# EAGLE design linefollower (EAGLE 9.4.2)
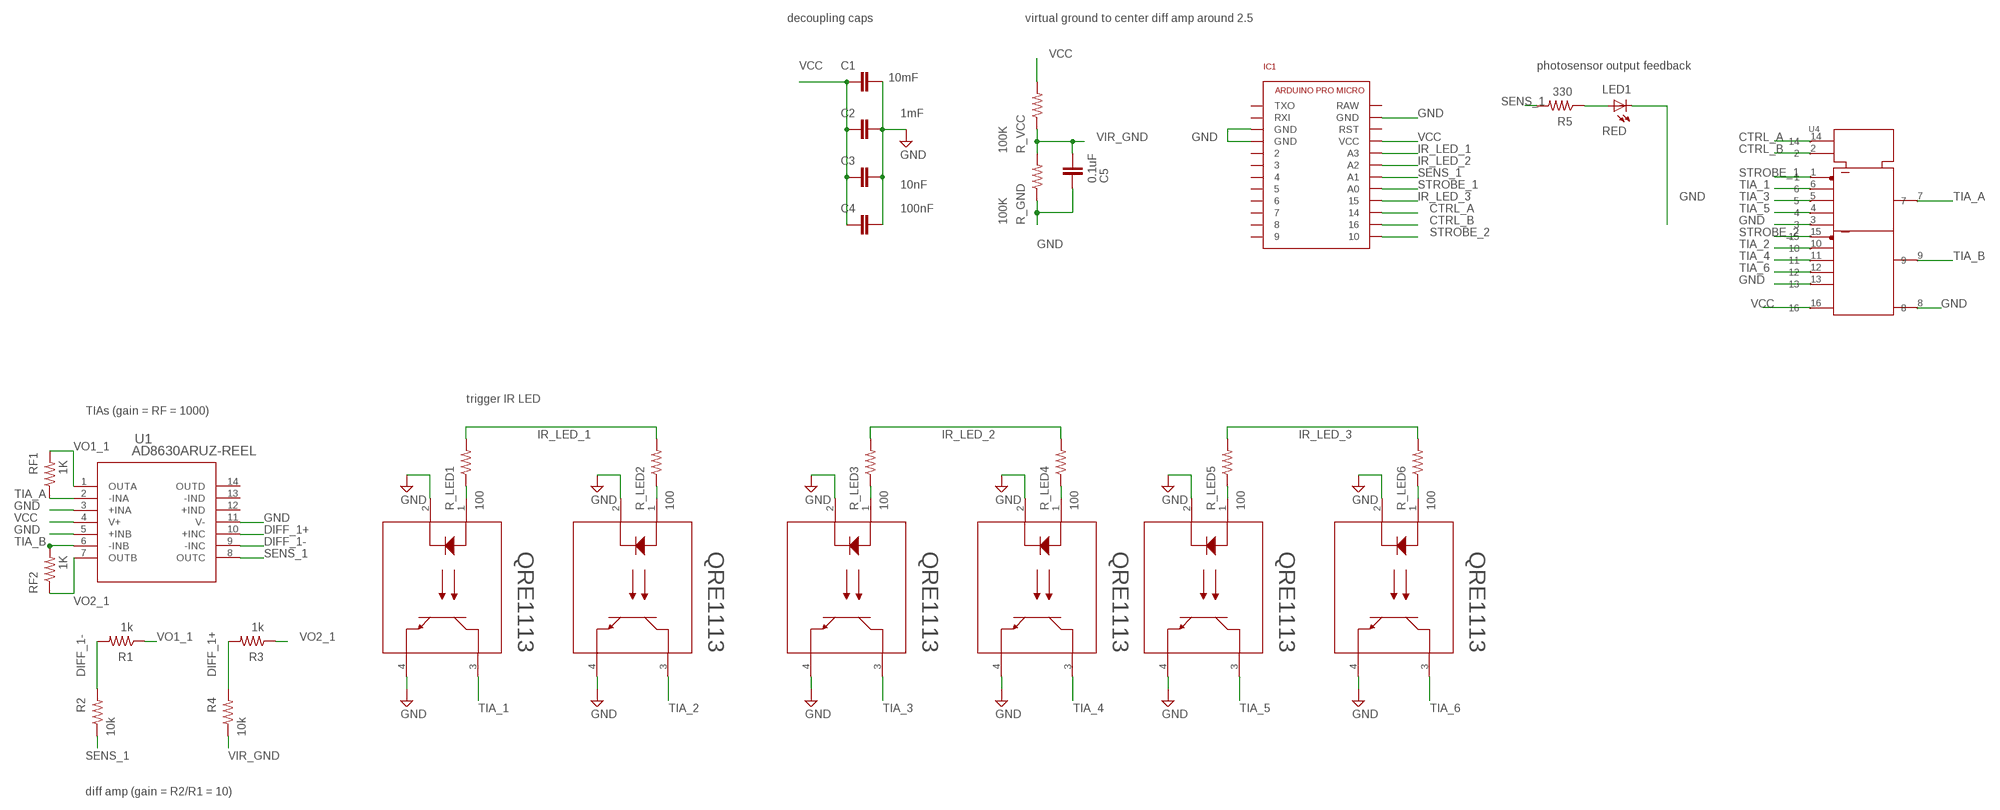
[diagram p0: schematic, sheet 1]

## Parts
C1  10mF  CAP0402-CAP  [0402-CAP]
C2  1mF  CAP0402-CAP  [0402-CAP]
C3  10nF  CAP0402-CAP  [0402-CAP]
C4  100nF  CAP0402-CAP  [0402-CAP]
C5  0.1uF  CAP0402-CAP  [0402-CAP]
IC1  ARDUINO_PRO_MICRO  [ARDUINO_PRO_MICRO]
LED1  RED  LED0603  [LED-0603]
Q1  QRE1113  [DIP4_100AQ_ONS]
Q2  QRE1113  [DIP4_100AQ_ONS]
Q3  QRE1113  [DIP4_100AQ_ONS]
Q4  QRE1113  [DIP4_100AQ_ONS]
Q5  QRE1113  [DIP4_100AQ_ONS]
Q6  QRE1113  [DIP4_100AQ_ONS]
R1  1k  R-US_R0603  [R0603]
R2  10k  R-US_R0603  [R0603]
R3  1k  R-US_R0603  [R0603]
R4  10k  R-US_R0603  [R0603]
R5  330  R-US_R0603  [R0603]
R_GND  100K  R-US_R0603  [R0603]
R_LED1  100  R-US_R0603  [R0603]
R_LED2  100  R-US_R0603  [R0603]
R_LED3  100  R-US_R0603  [R0603]
R_LED4  100  R-US_R0603  [R0603]
R_LED5  100  R-US_R0603  [R0603]
R_LED6  100  R-US_R0603  [R0603]
R_VCC  100K  R-US_R0603  [R0603]
RF1  1K  R-US_R0603  [R0603]
RF2  1K  R-US_R0603  [R0603]
U1  AD8630ARUZ-REEL  [RU_14_ADI]
U4  74VHC153FT(BJ)  [TSSOP16B_TOS]

## Nets
CTRL_A: IC1.14 U4.14
CTRL_B: IC1.16 U4.2
DIFF_1+: R3.2 R4.2 U1.10(+INC)
DIFF_1-: R1.2 R2.2 U1.9(-INC)
GND: C1.2 C2.2 C3.2 C4.2 C5.1 IC1.GND@0(GND) IC1.GND@1(GND) IC1.GND@2(GND) LED1.C Q1.2 Q1.4 Q2.2 Q2.4 Q3.2 Q3.4 Q4.2 Q4.4 Q5.2 Q5.4 Q6.2 Q6.4 R_GND.1 U1.3(+INA) U1.5(+INB) U1.11(V-) U4.3 U4.8 U4.13
IR_LED_1: IC1.A3 R_LED1.2 R_LED2.2
IR_LED_2: IC1.A2 R_LED3.2 R_LED4.2
IR_LED_3: IC1.15 R_LED5.2 R_LED6.2
N$1: Q2.1 R_LED2.1
N$2: LED1.A R5.1
N$3: Q1.1 R_LED1.1
N$6: Q3.1 R_LED3.1
N$7: Q4.1 R_LED4.1
N$8: Q5.1 R_LED5.1
N$9: Q6.1 R_LED6.1
SENS_1: IC1.A1 R2.1 R5.2 U1.8(OUTC)
STROBE_1: IC1.A0 U4.1
STROBE_2: IC1.10 U4.15
TIA_1: Q1.3 U4.6
TIA_2: Q2.3 U4.10
TIA_3: Q3.3 U4.5
TIA_4: Q4.3 U4.11
TIA_5: Q5.3 U4.4
TIA_6: Q6.3 U4.12
TIA_A: RF1.1 U1.2(-INA) U4.7
TIA_B: RF2.2 U1.6(-INB) U4.9
VCC: C1.1 C2.1 C3.1 C4.1 IC1.VCC R_VCC.2 U1.4(V+) U4.16
VIR_GND: C5.2 R4.1 R_GND.2 R_VCC.1
VO1_1: R1.1 RF1.2 U1.1(OUTA)
VO2_1: R3.1 RF2.1 U1.7(OUTB)
Unconnected: IC1.2 IC1.3 IC1.4 IC1.5 IC1.6 IC1.7 IC1.8 IC1.9 IC1.RAW IC1.RST IC1.RXI IC1.TXO U1.12(+IND) U1.13(-IND) U1.14(OUTD)

## Notes on the sheet
- decoupling caps | virtual ground to center diff amp around 2.5
- photosensor output feedback
- trigger IR LED
- TIAs (gain = RF = 1000)
- diff amp (gain = R2/R1 = 10)

## Library data of the parts
C1-C5 = pie:CAP: Capacitor Standard 0603 ceramic capacitor, and 0.1" leaded capacitor.; PIE-INT-REF-NUM: CAPACITOR-GENERIC
IC1 = pie:ARDUINO_PRO_MICRO: Arduino Pro Micro Electrical System Year 9's Smart Sensor Core Pin Outs <https://cdn.sparkfun.com/assets/9/c/3/c/4/523a1765757b7f5c6e8b4567.png> Buy Here <http://www.aliexpress.com/item/Mini-Leonardo-Pro-Micro-ATmega32U4-5V-16MHz-Module-For-Arduino-Best-Quality/32284746884.html?ws_ab_test=searchweb201556_8,searchweb201602_2_10057_10056_10065_10055_10054_10067_10069_10059_10058_10017_10070_10060_10061_10052_10062_10053_10050_10051,searchweb201603_1&btsid=45993952-29ca-4de4-a0fb-c7fb72b8e1a5> Thru Hole Female Pins <http://www.digikey.com/product-search/en?keywords=929974E-01-12-ND> Surface Mount Female Pins <http://www.digikey.com/product-detail/en/sullins-connector-solutions/NPTC121KFXC-RC/S5604-ND/776062>; DESCRIPTION: Arduino Pro Micro; DISTRIBUTOR: AliExpress; DISTRIBUTOR_PART_NUMBER: 32284746884; MANUFACTURER: Feiyang electronics; NOTES: https://www.aliexpress.com/item/Mini-Leonardo-Pro-Micro-ATmega32U4-5V-16MHz-Module-For-Arduino-Best-Quality/32284746884.html?ws_ab_test=searchweb201556_8,searchweb201602_2_10057_10056_10065_10055_10054_10067_10069_10059_10058_10017_10070_10060_10061_10052_10062_10053_10050_10051,searchweb201603_1&btsid=45993952-29ca-4de4-a0fb-c7fb72b8e1a5; PACKAGE: ARDUINO_PRO_MICRO; REFERENCE_DEST: ARDUINO_PRO_MICRO
LED1 = pie:LED: LEDs Standard schematic elements and footprints for 5mm, 3mm, 1206, and 0603 sized LEDs. 5mm - Spark Fun Electronics SKU : COM-00529 (and others); DESCRIPTION: LEDs; DISTRIBUTOR: DigiKey; DISTRIBUTOR_PART_NUMBER: 160-1415-1-ND; MANUFACTURER: Lite-On Inc; MANUFACTURER_PART_NUMBER: LTST-C170KRKT; PACKAGE: LED0603; VALUE: COLOR
Q1-Q6 = pie:QRE1113; BUILT_BY: EMA_Cory; COPYRIGHT: Copyright (C) 2018 Accelerated Designs. All rights reserved; DATASHEET: https://www.onsemi.com/pub/Collateral/QRE1113-D.PDF; MANUFACTURER_PART_NUMBER: QRE1113; SOURCELIBRARY: ON_Semiconudctor_2020-04-15; VENDOR: ON Semiconductor
R1-R5 R_GND R_LED1-R_LED6 R_VCC RF1 RF2 = pie:R-US_: RESISTOR, American symbol; DESCRIPTION: RESISTOR, American symbol; DISTRIBUTOR: DigiKey; MANUFACTURER: Rohm Semiconductor; NOTES: Cut Tape; PACKAGE: R0603; VALUE: >VALUE
U1 = pie:AD8630ARUZ-REEL; BUILT_BY: EMA_Christopher; COPYRIGHT: Copyright (C) 2016 Accelerated Designs. All rights reserved; MANUFACTURER_PART_NUMBER: AD8630ARUZ-REEL; SOURCELIBRARY: Analog_Devices_2018-07-13; VENDOR: Analog Devices Inc
U4 = pie:74VHC153FT(BJ); BUILT_BY: EMA_UL_Team; COPYRIGHT: Copyright (C) 2018 Accelerated Designs. All rights reserved; MANUFACTURER_PART_NUMBER: 74VHC153FT(BJ); SOURCELIBRARY: Toshiba_2019-12-10; VENDOR: Toshiba

## Board
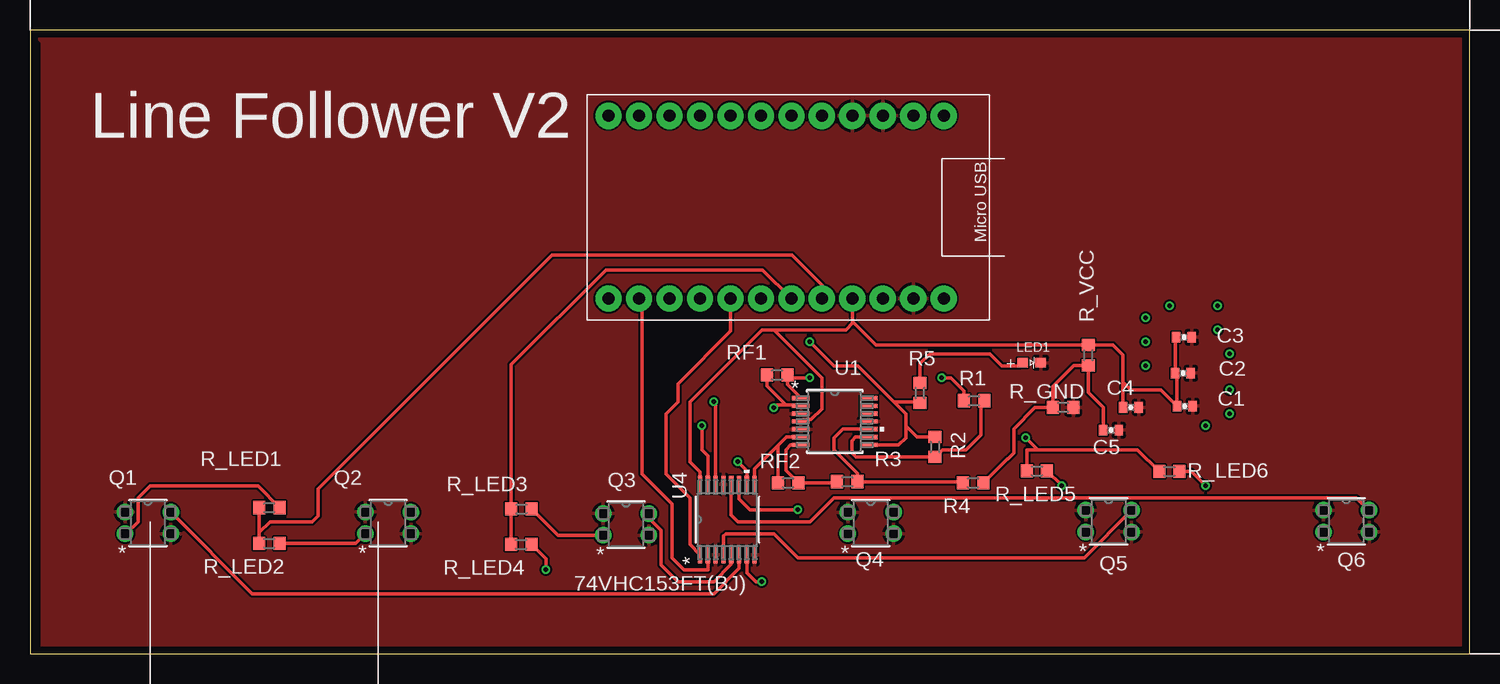
[diagram p1: board, top side]
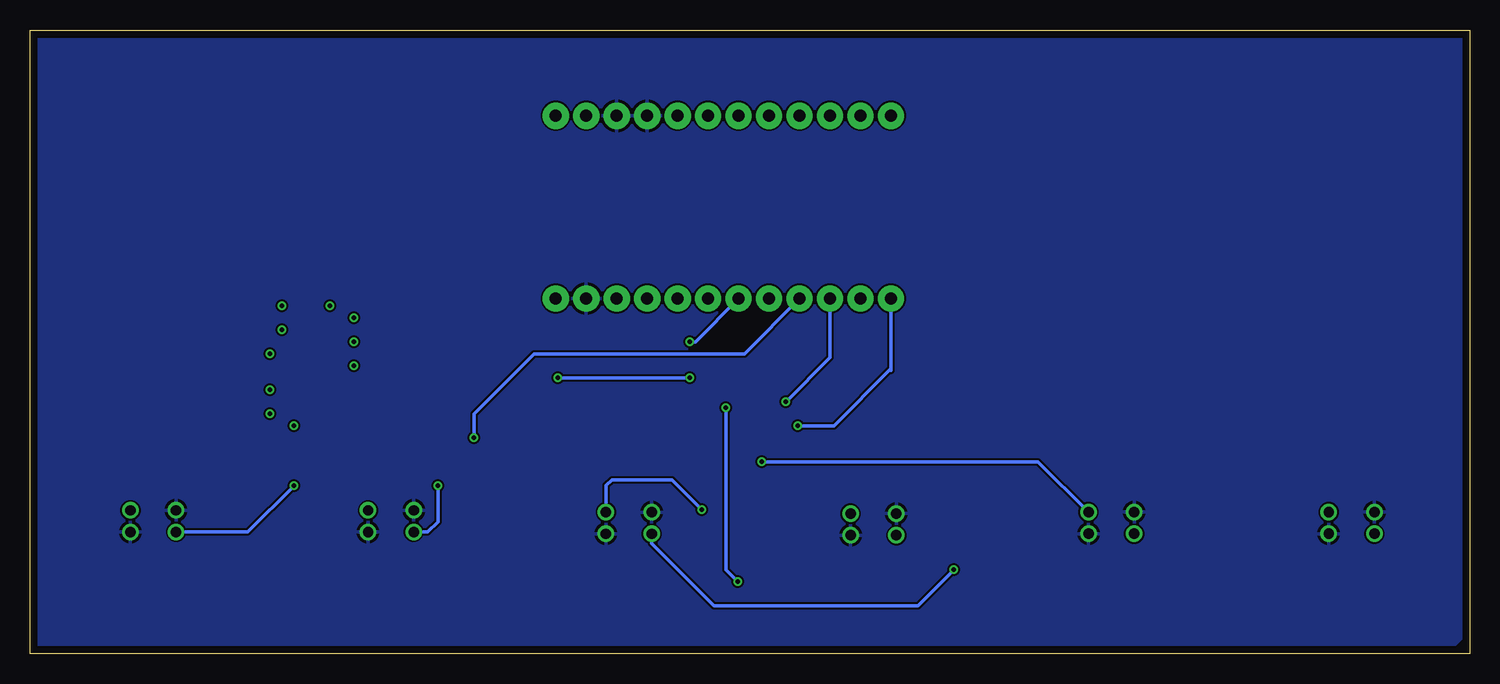
[diagram p2: board, bottom side, seen from below]

Size 120 x 52 mm. Coordinates in mm from the lower left corner, seen from the top.
Outline: 0,0 120,0 120,52 0,52 0,0
Copper layers (1*16): Top 2mil / dielectric 9mil / Bottom 2mil
Design rules "pie": minimum track width 6mil, minimum drill 15mil, track to track 6mil, track to pad 6mil, pad to pad 6mil, via to via 6mil, smd to smd 6mil, copper to edge 25mil, drill to drill 7mil, minimum pad ring 7mil, minimum via ring 7mil, stop-mask expansion 3mil, vias tented up to drill 21mil, thermal gap 10mil

### Footprints (pad centres in the part's own frame; a part is rotated, then mirrored left to right if it is on the bottom)
0402-CAP = smd 0.7 x 0.9: 1 -0.65,0; 2 0.65,0
ARDUINO_PRO_MICRO = drill 1 pad 2.184: 2 1.778,19.558; 3 1.778,17.018; 4 1.778,14.478; 5 1.778,11.938; 6 1.778,9.398; 7 1.778,6.858; 8 1.778,4.318; 9 1.778,1.778; 10 17.018,1.778; 14 17.018,6.858; 15 17.018,9.398; 16 17.018,4.318; A0 17.018,11.938; A1 17.018,14.478; A2 17.018,17.018; A3 17.018,19.558; GND@0 1.778,24.638; GND@1 1.778,22.098; GND@2 17.018,27.178; RAW 17.018,29.718; RST 17.018,24.638; RXI 1.778,27.178; TXO 1.778,29.718; VCC 17.018,22.098
LED-0603 = smd 0.8 x 0.889: A 0,-0.75; C 0,0.75
DIP4_100AQ_ONS = drill 0.864 pad 1.372: 1 0,0; 2 3.81,0; 3 3.81,1.803; 4 0,1.803
R0603 = smd 1 x 1.1: 1 -0.85,0; 2 0.85,0
RU_14_ADI = smd 1.461 x 0.351: 1 -2.825,1.95; 2 -2.825,1.3; 3 -2.825,0.65; 4 -2.825,0; 5 -2.825,-0.65; 6 -2.825,-1.3; 7 -2.825,-1.95; 8 2.825,-1.95; 9 2.825,-1.3; 10 2.825,-0.65; 11 2.825,0; 12 2.825,0.65; 13 2.825,1.3; 14 2.825,1.95
TSSOP16B_TOS = smd 1.46 x 0.356: 1 -2.927,2.275; 2 -2.927,1.625; 3 -2.927,0.975; 4 -2.927,0.325; 5 -2.927,-0.325; 6 -2.927,-0.975; 7 -2.927,-1.625; 8 -2.927,-2.275; 9 2.927,-2.275; 10 2.927,-1.625; 11 2.927,-0.975; 12 2.927,-0.325; 13 2.927,0.325; 14 2.927,0.975; 15 2.927,1.625; 16 2.927,2.275

### Placement (x,y rotation side)
C1  96.27,20.63 0 top
C2  96.11,23.38 0 top
C3  96.19,26.38 0 top
C4  91.77,20.53 0 top
C5  90.12,18.63 180 top
IC1  46.45,46.62 270 top
LED1  83.5,24.25 270 top
Q1  7.92,9.99 0 top
Q2  27.95,9.99 0 top
Q3  47.78,9.87 0 top
Q4  68.18,9.98 0 top
Q5  88.01,10.14 0 top
Q6  107.82,10.14 0 top
R1  78.7,21.08 0 top
R2  75.44,17.23 270 top
R3  68.14,14.33 0 top
R4  78.61,14.23 180 top
R5  74.18,21.73 270 top
R_GND  86.12,20.53 180 top
R_LED1  19.95,12.16 180 top
R_LED2  19.95,9.18 180 top
R_LED3  40.97,12.05 180 top
R_LED4  40.95,9.1 180 top
R_LED5  83.94,15.22 180 top
R_LED6  94.98,15.18 180 top
R_VCC  88.22,24.88 90 top
RF1  62.28,23.23 0 top
RF2  63.2,14.23 180 top
U1  67.08,19.35 0 top
U4  58.13,11.16 90 top

### Tracks (layer width: path | path; a pad name or v marks a point on that pad's centre or on a via)
CTRL_A  (via drill 0.35)
  Top 0.305: v57,21 57.16,20.84 U4.14
  Bottom 0.305: v57,21 53.31,24.69 IC1.14
CTRL_B
  Top 0.305: IC1.16 51,29.37 51,15 53.5,12.5 53.5,8 54.5,7 56.5,7 56.51,7 U4.2
DIFF_1+
  Top 0.305: U1.10 69.86,18.75 67.75,18.75 67,18 67,17 68.99,15.01 R3.2 77.66,14.33 R4.2
DIFF_1-
  Top 0.305: U1.9 68.8,18.05 68.5,17.75 68.5,16.75 68.87,16.38 R2.2 76.06,17 78,17 79.25,18.25 79.25,20.78 R1.2
GND
  pour Top: 0,52 120,52 120,-1 2,-1 1,0 1,51
  pour Bottom: 0,52 120,52 121,53 121,1 120,0 2,0 0,2
IR_LED_1
  Top 0.305: R_LED2.2 19.09,9.75 19.09,10.1 | 19.09,10.1 R_LED1.2 | IC1.A3 66.01,30.74 63.5,33.25 43.5,33.25 24,13.75 24,11.5 23.5,11 20,11 19.09,10.1
IR_LED_2
  Top 0.305: R_LED4.2 40.1,12.04 R_LED3.2 40.12,24.11 48,32 61.07,32 IC1.A2
IR_LED_3  (via drill 0.35)
  Top 0.305: R_LED5.2 83.09,17 84,17 | R_LED6.2 92.31,17 84.86,17 84,17 | v83,18 84,17
  Bottom 0.305: IC1.15 60.45,25 78,25 83,20 v83,18
N$1
  Top 0.305: R_LED2.1 27.14,9.18 Q2.1
N$2
  Top 0.305: R5.1 74.18,24.18 75,25 80,25 81,24 82.5,24 LED1.A
N$3
  Top 0.305: R_LED1.1 19,13.96 19,14 10,14 9,13 9,11 7.99,9.99 Q1.1
N$4  (via drill 0.35)
  other vias: 93,26
N$5  (via drill 0.35)
  other vias: 93,28
N$6
  Top 0.305: R_LED3.1 44,9.87 Q3.1
N$7  (via drill 0.35)
  Top 0.305: R_LED4.1 43,7.89 v43,7
  Bottom 0.305: Q4.1 68.18,9.18 63,4 46,4 v43,7
N$8  (via drill 0.35)
  Top 0.305: R_LED5.1 v86,14.01 v86,14
  Bottom 0.305: v86,14 86,11 86.86,10.14 Q5.1
N$9  (via drill 0.35)
  Top 0.305: R_LED6.1 96.82,15.18 v98,14
  Bottom 0.305: v98,14 101.86,10.14 Q6.1
N$10  (via drill 0.35)
  other vias: 95,29
N$11  (via drill 0.35)
  other vias: 99,29
N$12  (via drill 0.35)
  other vias: 99,27
N$13  (via drill 0.35)
  other vias: 100,25
N$14  (via drill 0.35)
  other vias: 100,22
N$15  (via drill 0.35)
  other vias: 100,20
N$16  (via drill 0.35)
  other vias: 93,24
N$17  (via drill 0.35)
  other vias: 98,19
SENS_1  (via drill 0.35)
  Top 0.305: v65,26 67,24 69,24 72,21 | U1.8 72.4,17.4 73,18 73,19 | 73,19 73,20 72,21 | R2.1 73.92,18.08 73,19 | 72,21 74.06,21 R5.2
  Bottom 0.305: v65,26 64.53,26 IC1.A1
STROBE_1
  Top 0.305: U4.1 55,9.09 55,13 53,15 53,20 54,21 54,22.5 58.39,26.89 IC1.A0
STROBE_2  (via drill 0.35)
  Top 0.305: U4.15 56.51,16.5 56,17 v56,19
  Bottom 0.305: v56,19 53,19 48.31,23.69 48.23,23.6 IC1.10
TIA_1
  Top 0.305: Q1.3 18.53,5 57,5 59.1,7.11 U4.6
TIA_2  (via drill 0.35)
  Top 0.305: v59,16 59.76,15.24 U4.10
  Bottom 0.305: Q2.3 35.97,16 v59,16
TIA_3
  Top 0.305: Q3.3 51.59,11.27 52.58,10.28 52.58,7.42 54,6 57,6 58.45,7.46 U4.5
TIA_4  (via drill 0.35)
  Top 0.305: U4.11 59.1,12.89 60,12 v64,12
  Bottom 0.305: Q4.3 71.99,13.99 71.99,14.01 71.5,14.5 66.5,14.5 v64,12
TIA_5
  Top 0.305: Q5.3 87.88,8 64,8 62,10 58,10 57.8,9.8 U4.4
TIA_6
  Top 0.305: U4.12 58.45,11.54 59,11 65,11 67,13 110.57,13 Q6.3
TIA_A  (via drill 0.35)
  Top 0.305: U4.7 59.76,6.75 60.5,6 v61,6 | v62,20.5 62.25,20.75 63,20.75 | 63,20.75 64.16,20.75 U1.2 | 63,20.75 61.43,22.32 RF1.1
  Bottom 0.305: v61,6 62,7 v62,20.5
TIA_B
  Top 0.305: U4.9 60.41,15.4 62.35,17.35 | U1.6 63.05,18.05 62.35,17.35 | RF2.2 62.35,17.35
VCC
  Top 0.305: U4.16 55.85,15.14 55,16 55,21 61,27 62,27 | U1.4 64.42,19.52 65.11,19.52 66,20.41 66,23 62,27 | 62,27 68,27 68.55,27.55 | 68.55,27.55 IC1.VCC | C4.1 91.12,22.63 | 91.12,22.63 91.12,24.88 90.27,25.73 88.5,25.73 R_VCC.2 70.52,25.73 68.7,27.55 68.55,27.55 | 91.12,22.63 91.75,22 94.25,22 C1.1 95.62,23.22 C2.1 95.46,26.3 C3.1
VIR_GND
  Top 0.305: R4.1 81.48,16.25 81.5,16.25 82,16.75 82,18.75 83.78,20.53 R_GND.2 85.27,22.27 87.03,24.03 R_VCC.1 88.22,21.78 89.47,20.53 C5.2
VO1_1  (via drill 0.35)
  Top 0.305: U1.1 63.13,22.43 RF1.2 63.36,23 v65,23 | v76,23 76.75,23 77.85,21.9 R1.1
  Bottom 0.305: v65,23 v76,23
VO2_1
  Top 0.305: U1.7 63.4,17.4 63,17 63,15.28 RF2.1 67.19,14.23 R3.1

### Text on the board
tNames: Line Follower V2